# Altium schematic sheet Ethernet.SchDoc: =SheetTitle
size B; SheetTitle: W5500 Ethernet Controller; DrawnBy: Samyar Sadat Akhavi; SheetNumber: 6; SheetTotal: 19
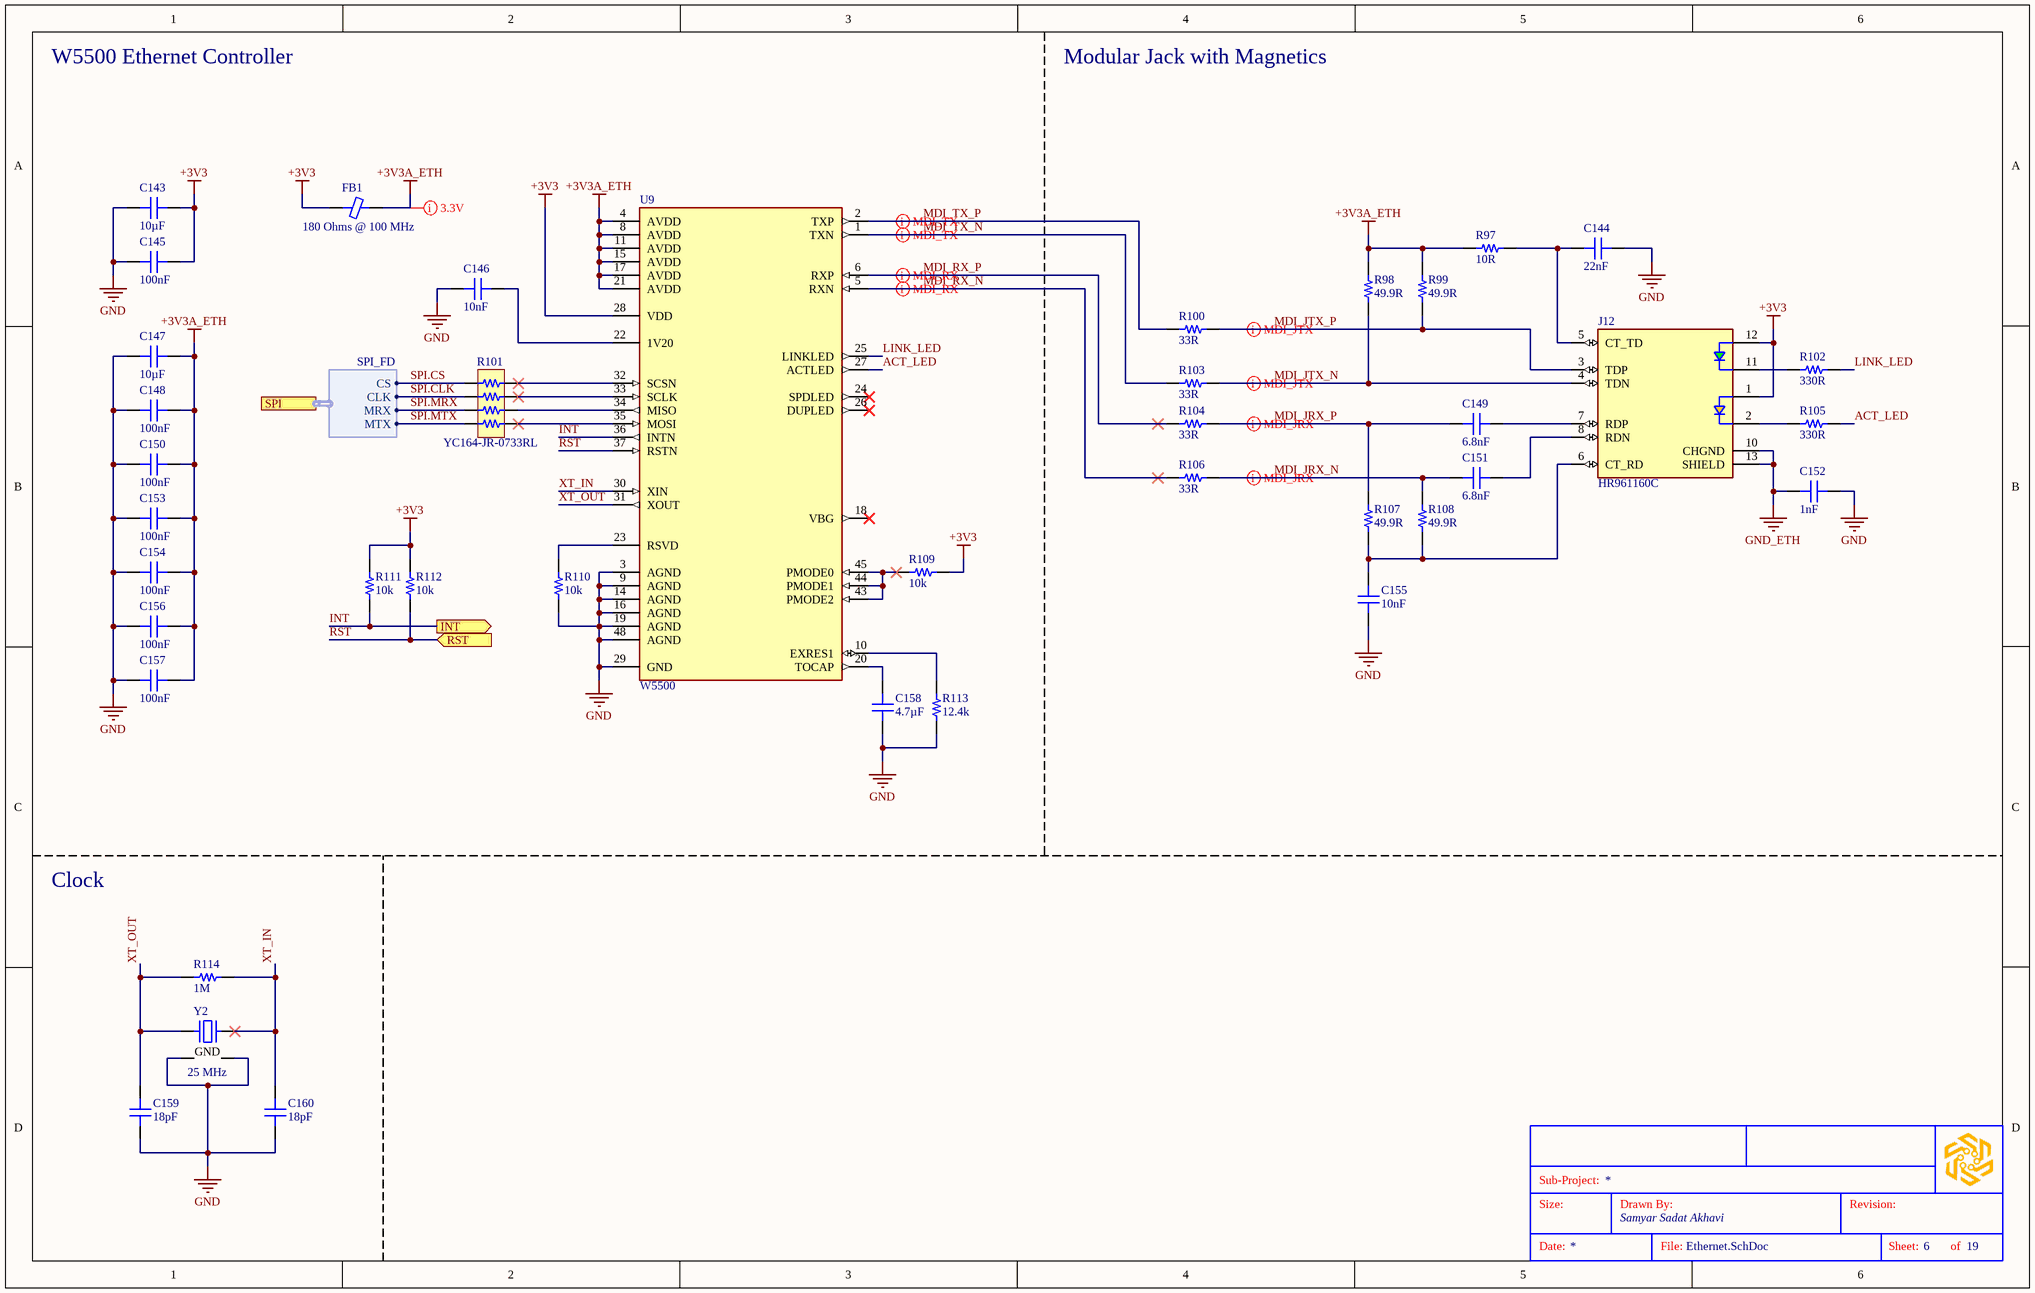
[diagram p0: Ethernet.SchDoc]

## Parts
?  (no value)  (graphical)
C143  10µF  [CAP 1206_3216]
C144  22nF  [CAP 0603_1608]
C145  100nF  [CAP 0603_1608]
C146  10nF  [CAP 0603_1608]
C147  10µF  [CAP 1206_3216]
C148  100nF  [CAP 0603_1608]
C149  6.8nF  [CAP 0603_1608]
C150  100nF  [CAP 0603_1608]
C151  6.8nF  [CAP 0603_1608]
C152  1nF  [CAP 1206_3216]
C153  100nF  [CAP 0603_1608]
C154  100nF  [CAP 0603_1608]
C155  10nF  [CAP 0603_1608]
C156  100nF  [CAP 0603_1608]
C157  100nF  [CAP 0603_1608]
C158  4.7µF  [CAP 0603_1608]
C159  18pF  [CAP 0603_1608]
C160  18pF  [CAP 0603_1608]
FB1  180 Ohms @ 100 MHz  [FER 0603_1608]
J12  HR961160C  [HANRUN_HR961160C]
R97  10R  [RES 0603_1608]
R98  49.9R  [RES 0603_1608]
R99  49.9R  [RES 0603_1608]
R100  33R  [RES 0603_1608]
R101  YC164-JR-0733RL  [RESNET 1206-8 CONVEX]
R102  330R  [RES 0603_1608]
R103  33R  [RES 0603_1608]
R104  33R  [RES 0603_1608]
R105  330R  [RES 0603_1608]
R106  33R  [RES 0603_1608]
R107  49.9R  [RES 0603_1608]
R108  49.9R  [RES 0603_1608]
R109  10k  [RES 0603_1608]
R110  10k  [RES 0603_1608]
R111  10k  [RES 0603_1608]
R112  10k  [RES 0603_1608]
R113  12.4k  [RES 0603_1608]
R114  1M  [RES 0603_1608]
U9  W5500  [48LQFP_W5500_WIZ]
Y2  25 MHz  [EPSON TSX-3225]

## Ports
INT (out, see Power_Board[3B]), RST (in, see Power_Board[3B]), SPI (harness SPI_FD, see Power_Board[3B])

## Harnesses
SPI_FD: CLK, CS, MRX, MTX

## Nets
+3V3: C143.2 C145.1 FB1.1 J12.1(YLW_A) J12.12(GRN_A) R109.1 R111.2 R112.1 U9.28(VDD)
+3V3A_ETH: C147.2 C148.1 C150.1 C153.1 C154.1 C156.1 C157.1 FB1.2 R97.2 R98.2 R99.2 U9.4(AVDD) U9.8(AVDD) U9.11(AVDD) U9.15(AVDD) U9.17(AVDD) U9.21(AVDD)
GND: C143.1 C144.2 C145.2 C146.2 C147.1 C148.2 C150.2 C152.1 C153.2 C154.2 C155.2 C156.2 C157.2 C158.1 C159.1 C160.1 R110.2 R113.1 U9.3(AGND) U9.9(AGND) U9.14(AGND) U9.16(AGND) U9.19(AGND) U9.29(GND) U9.48(AGND) Y2.2(GND) Y2.4(GND)
GND_ETH: C152.2 J12.10(CHGND) J12.13(SHIELD)
ACT_LED: R105.2 U9.27(ACTLED)
INT: R111.1 U9.36(INTN) ; port INT
LINK_LED: R102.2 U9.25(LINKLED)
MDI_JRX_N: C151.1 R106.2 R108.2
MDI_JRX_P: C149.2 R104.2 R107.2
MDI_JTX_N: J12.4(TDN) R98.1 R103.2
MDI_JTX_P: J12.3(TDP) R99.1 R100.2
MDI_RX_N: R106.1 U9.5(RXN)
MDI_RX_P: R104.1 U9.6(RXP)
MDI_TX_N: R103.1 U9.1(TXN)
MDI_TX_P: R100.1 U9.2(TXP)
RST: R112.2 U9.37(RSTN) ; port RST
SPI.CLK: R101.2 ; port SPI.CLK
SPI.CS: R101.1 ; port SPI.CS
SPI.MRX: R101.3 ; port SPI.MRX
SPI.MTX: R101.4 ; port SPI.MTX
XT_IN: C160.2 R114.2 U9.30(XIN) Y2.3
XT_OUT: C159.2 R114.1 U9.31(XOUT) Y2.1
NetC144_1: C144.1 J12.5(CT_TD) R97.1
NetC146_1: C146.1 U9.22(1V20)
NetC149_1: C149.1 J12.7(RDP)
NetC151_2: C151.2 J12.8(RDN)
NetC155_1: C155.1 J12.6(CT_RD) R107.1 R108.1
NetC158_2: C158.2 U9.20(TOCAP)
NetJ12_2: J12.2(YLW_K) R105.1
NetJ12_11: J12.11(GRN_K) R102.1
NetR101_5: R101.5 U9.35(MOSI)
NetR101_6: R101.6 U9.34(MISO)
NetR101_7: R101.7 U9.33(SCLK)
NetR101_8: R101.8 U9.32(SCSN)
NetR109_2: R109.2 U9.43(PMODE2) U9.44(PMODE1) U9.45(PMODE0)
NetR110_1: R110.1 U9.23(RSVD)
NetR113_2: R113.2 U9.10(EXRES1)

Not connected (* = marked no-connect by the designer): U9 18(VBG)* 24(SPDLED)* 26(DUPLED)*

## Layout directives
differential pair: MDI_JRX_N, MDI_JRX_P, MDI_JTX_N, MDI_JTX_P, MDI_RX_N, MDI_RX_P, MDI_TX_N, MDI_TX_P
rule Supply Nets [Voltage = 3.300]: +3V3A_ETH

## Notes on the sheet
- W5500 Ethernet Controller
- Modular Jack with Magnetics
- Clock
- Sub-Project:
- Size:
- Drawn By:
- Revision:
- Date:
- File:
- Sheet:
- of

## Library data of the parts
? = SGR-STDTBSB: STANDARD SCHEMATICS TITLE BLOCK
C143 C147 = GEN-CC10UT10V25KX7R1206: GENERIC 1206 MLC CAPACITOR; Tolerance: ±10%; Voltage: 25V; Dielectric: X7R; Part Number: GEN-CC10UT10V25KX7R1206; Value: 10µF
C144 = GEN-CC22NT20V25KX7R603: GENERIC 0603 MLC CAPACITOR; Tolerance: ±20%; Voltage: 25V; Dielectric: X7R; Part Number: GEN-CC22NT20V25KX7R603; Value: 22nF
C145 C148 C150 C153 C154 C156 C157 = GEN-CC100NT10V50KX7R603: GENERIC 0603 MLC CAPACITOR; Tolerance: ±10%; Voltage: 50V; Dielectric: X7R; Part Number: GEN-CC100NT10V50KX7R603; Value: 100nF
C146 C155 = GEN-CC10NT10V50KX7R603: GENERIC 0603 MLC CAPACITOR; Tolerance: ±10%; Voltage: 50V; Dielectric: X7R; Part Number: GEN-CC10NT10V50KX7R603; Value: 10nF
C149 C151 = GEN-CC6N8T10V50KX7R603: GENERIC 0603 MLC CAPACITOR; Tolerance: ±10%; Voltage: 50V; Dielectric: X7R; Part Number: GEN-CC6N8T10V50KX7R603; Value: 6.8nF
C152 = GEN-CC1NT10V2000KX7R1206: GENERIC 1206 MLC CAPACITOR; Tolerance: ±10%; Voltage: 2000V; Dielectric: X7R; Part Number: GEN-CC1NT10V2000KX7R1206; Value: 1nF
C158 = GEN-CC4U7T106V3KX7R603: GENERIC 0603 MLC CAPACITOR; Tolerance: ±10%; Voltage: 6.3V; Dielectric: X7R; Part Number: GEN-CC4U7T106V3KX7R603; Value: 4.7µF
C159 C160 = GEN-CC18PT5V50KC0G603: GENERIC 0603 MLC CAPACITOR; Tolerance: ±5%; Voltage: 50V; Dielectric: C0G; Part Number: GEN-CC18PT5V50KC0G603; Value: 18pF
FB1 = MPZ1608S181ATAH0: FERRITE BEAD 180 OHM 0603 1LN; Manufacturer: TDK Corporation; Current Rating (Max): 2A; DC Resistance (DCR) (Max): 50mOhm; Filter Type: Power Line; Number of Lines: 1; Part Number: MPZ1608S181ATAH0; ComponentLink1Description: Datasheet; ComponentLink1URL: https://product.tdk.com/info/en/catalog/datasheets/beads_commercial_power_mpz1608_en.pdf?ref_disty=digikey; ComponentLink2Description: DigiKey Link; ComponentLink2URL: https://www.digikey.com/en/products/detail/tdk-corporation/MPZ1608S181ATAH0/2117944; Device Package: 0603 (1608 Metric); Height (Max): 0.030" (0.75mm); Impedance @ Frequency: 180 Ohms @ 100 MHz; LastUpdated: 4/5/2026 8:28:05 PM; Lifecycle Status: Active; Minimum Order: 1; Mounting Type: Surface Mount; Operating Temperature: -55°C ~ 125°C; Package / Case: 0603 (1608 Metric); Packaging: TapeAndReel; PartId: 1025; Part Status: Active; Price: 0.02; Series: MPZ; Size / Dimension: 0.063" L x 0.031" W (1.60mm x 0.80mm); Supplier 1: DigiKey; Supplier Part Number 1: 445-MPZ1608S181ATAH0CT-ND; Value: 180 Ohms @ 100 MHz
J12 = HR961160C: MAGJACK SMT R/A 8P8C RJ45 ETHERNET; Manufacturer: HanRun; Part Number: HR961160C; Supplier 1: Ozdisan; Supplier Part Number 1: HR961160C
R97 = GEN-CRR10T1P8603: GENERIC 0603 CHIP RESISTOR; Tolerance: ±1%; Power: 0.125W; Part Number: GEN-CRR10T1P8603; Value: 10R
R98 R99 R107 R108 = GEN-CRR49R9T1P8603: GENERIC 0603 CHIP RESISTOR; Tolerance: ±1%; Power: 0.125W; Part Number: GEN-CRR49R9T1P8603; Value: 49.9R
R100 R103 R104 R106 = GEN-CRR33T1P8603: GENERIC 0603 CHIP RESISTOR; Tolerance: ±1%; Power: 0.125W; Part Number: GEN-CRR33T1P8603; Value: 33R
R101 = YC164-JR-0733RL: RES ARRAY 4 RES 33 OHM 1206; Manufacturer: Yageo; Circuit Type: Isolated; Number of Resistors: 4; Power Per Element: 62.5mW; Resistance (Ohms): 33; Temperature Coefficient: ±200ppm/°C; Tolerance: ±5%; Part Number: YC164-JR-0733RL; Applications: DDRAM, SDRAM; ComponentLink1Description: Datasheet; ComponentLink1URL: https://www.yageo.com/upload/media/product/productsearch/datasheet/rchip/PYu-YC_TC_group_51_RoHS_L_9.pdf; ComponentLink2Description: DigiKey Link; ComponentLink2URL: http://digikey.com/product-detail/en/yageo/YC164-JR-0733RL/YC164J-33CT-ND/1005642; Height - Seated (Max): 0.028" (0.70mm); LastUpdated: 9/2/2020 1:23:24 AM; Lifecycle Status: Active; Minimum Order: 1; Mounting Type: Surface Mount; Number of Pins: 8; Operating Temperature: -55°C ~ 155°C; Package / Case: 1206 (3216 Metric), Convex, Long Side Terminals; Packaging: TapeAndReel; PartId: 145; Part Status: Active; Price: 0.01; Series: YC164; Size / Dimension: 0.126" L x 0.063" W (3.20mm x 1.60mm); Supplier 1: DigiKey; Supplier Part Number 1: YC164J-33CT-ND
R102 R105 = GEN-CRR330T5P8603: GENERIC 0603 CHIP RESISTOR; Tolerance: ±5%; Power: 0.125W; Part Number: GEN-CRR330T5P8603; Value: 330R
R109-R112 = GEN-CRR10KT1P8603: GENERIC 0603 CHIP RESISTOR; Tolerance: ±1%; Power: 0.125W; Part Number: GEN-CRR10KT1P8603; Value: 10k
R113 = GEN-CRR12K4T1P8603: GENERIC 0603 CHIP RESISTOR; Tolerance: ±1%; Power: 0.125W; Part Number: GEN-CRR12K4T1P8603; Value: 12.4k
R114 = GEN-CRR1MT5P8603: GENERIC 0603 CHIP RESISTOR; Tolerance: ±5%; Power: 0.125W; Part Number: GEN-CRR1MT5P8603; Value: 1M
U9 = W5500: IC CTLR 3-1 ETH TCP/IP 48LQFP; Manufacturer: WIZnet; Copyright: Copyright (C) 2025 Ultra Librarian. All rights reserved.; Part Number: W5500; Supplier 1: DigiKey; Supplier Part Number 1: 1278-W5500CT-ND
Y2 = TSX-3225 25.0000MF20P-C0: CRYSTAL 25.0000MHZ 18PF SMD; Manufacturer: EPSON; ESR (Equivalent Series Resistance): 40 Ohms; Frequency Stability: ±20ppm; Frequency Tolerance: ±10ppm; Operating Mode: Fundamental; Part Number: TSX-3225 25.0000MF20P-C0; ComponentLink1Description: Datasheet; ComponentLink1URL: https://support.epson.biz/td/api/doc_check.php?dl=brief_TSX-3225&lang=en; ComponentLink2Description: DigiKey Link; ComponentLink2URL: https://www.digikey.com/en/products/detail/epson/TSX-3225-25-0000MF20P-C0/7430947; Frequency: 25 MHz; Height - Seated (Max): 0.024" (0.60mm); LastUpdated: 4/5/2026 8:41:19 PM; Lifecycle Status: Active; Load Capacitance: 18pF; Minimum Order: 1; Mounting Type: Surface Mount; Operating Temperature: -20°C ~ 85°C; Package / Case: 4-SMD, No Lead; Packaging: TapeAndReel; PartId: 447; Part Status: Active; Price: 0.21; Series: TSX-3225; Size / Dimension: 0.126" L x 0.098" W (3.20mm x 2.50mm); Supplier 1: DigiKey; Supplier Part Number 1: SER4212CT-ND; Type: MHz Crystal; Value: 25 MHz